# EAGLE design osmc_strip (EAGLE 5.10)
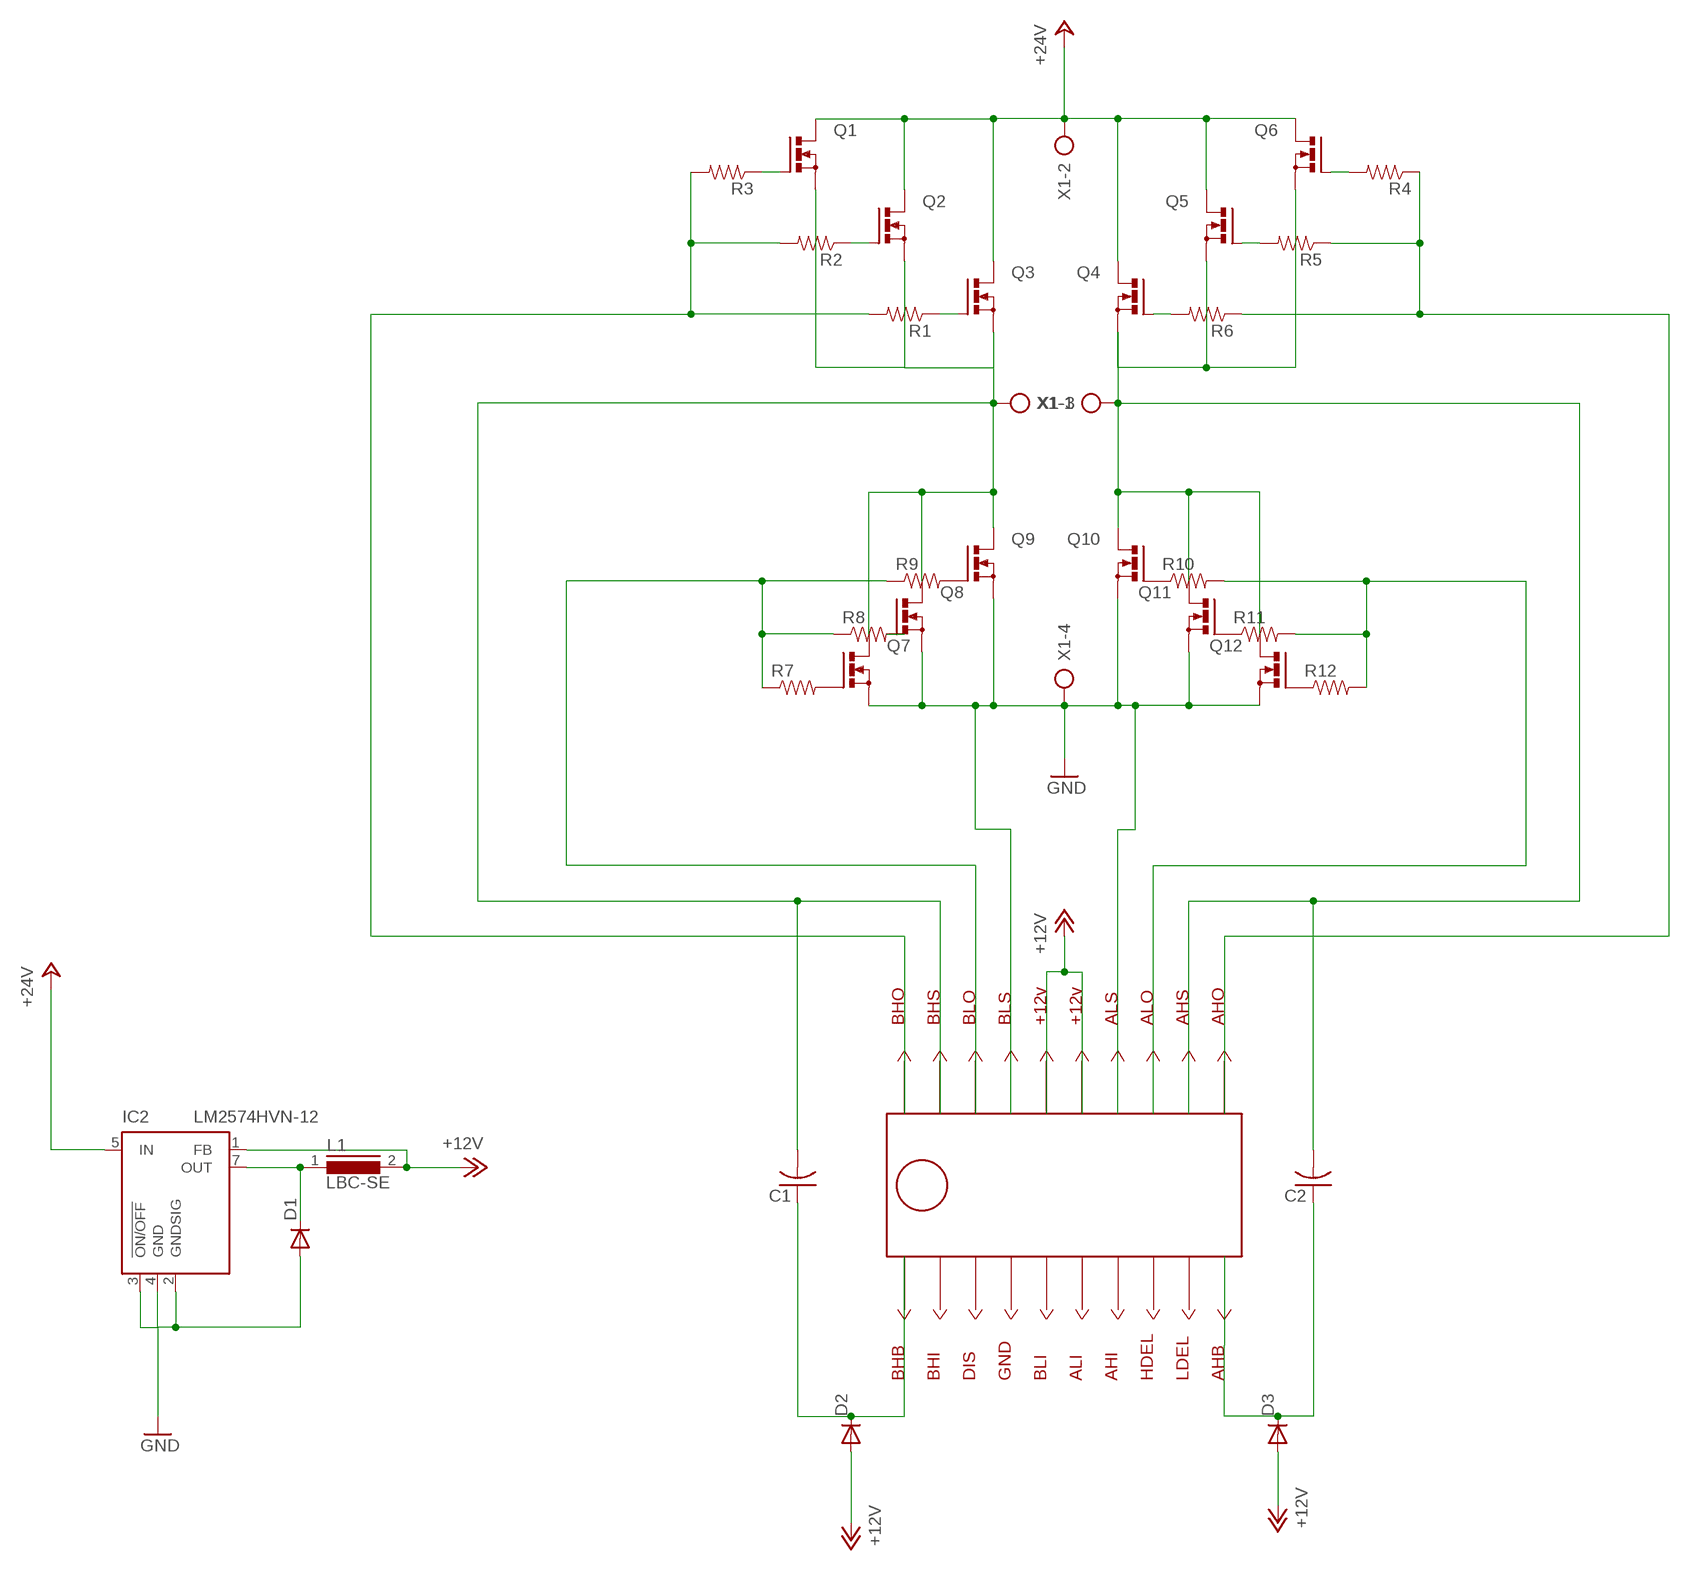
[diagram p0: schematic, sheet 1]

## Parts
C1  C-US050-030X075  [C050-030X075]
C2  C-US050-030X075  [C050-030X075]
D1  DIODEPTH  [DIODE-1N4001]
D2  DIODEPTH  [DIODE-1N4001]
D3  DIODEPTH  [DIODE-1N4001]
IC1  HIP4081  [HIP4081]
IC2  LM2574HVN-12  [DIL08]
L1  LBC-SE  [LBC-SE]
Q1  PMOSFET_NTO220BV  [TO220BV]
Q2  PMOSFET_NTO220BV  [TO220BV]
Q3  PMOSFET_NTO220BV  [TO220BV]
Q4  PMOSFET_NTO220BV  [TO220BV]
Q5  PMOSFET_NTO220BV  [TO220BV]
Q6  PMOSFET_NTO220BV  [TO220BV]
Q7  PMOSFET_NTO220BV  [TO220BV]
Q8  PMOSFET_NTO220BV  [TO220BV]
Q9  PMOSFET_NTO220BV  [TO220BV]
Q10  PMOSFET_NTO220BV  [TO220BV]
Q11  PMOSFET_NTO220BV  [TO220BV]
Q12  PMOSFET_NTO220BV  [TO220BV]
R1  RESISTORPTH-1/6W  [1/6W-RES]
R2  RESISTORPTH-1/6W  [1/6W-RES]
R3  RESISTORPTH-1/6W  [1/6W-RES]
R4  RESISTORPTH-1/6W  [1/6W-RES]
R5  RESISTORPTH-1/6W  [1/6W-RES]
R6  RESISTORPTH-1/6W  [1/6W-RES]
R7  RESISTORPTH-1/6W  [1/6W-RES]
R8  RESISTORPTH-1/6W  [1/6W-RES]
R9  RESISTORPTH-1/6W  [1/6W-RES]
R10  RESISTORPTH-1/6W  [1/6W-RES]
R11  RESISTORPTH-1/6W  [1/6W-RES]
R12  RESISTORPTH-1/6W  [1/6W-RES]
X1  AK500/4  [AK500/4]

## Nets
+12V: D2.A D3.A IC1.15(VCC) IC1.16(+12V) IC2.1(FB) L1.2
+24V: IC2.5(IN) Q1.D Q2.D Q3.D Q4.D Q5.D Q6.D X1.2
GND: D1.A IC1.14(ALS) IC1.17(BLS) IC2.2(GNDSIG) IC2.3(!ON/OFF) IC2.4(GND) Q7.S Q8.S Q9.S Q10.S Q11.S Q12.S X1.4
N$1: C1.2 IC1.19(BHS) Q1.S Q2.S Q3.S Q7.D Q8.D Q9.D X1.3
N$2: C2.2 IC1.12(AHS) Q4.S Q5.S Q6.S Q10.D Q11.D Q12.D X1.1
N$3: IC1.11(AHO) R4.1 R5.1 R6.1
N$4: C1.1 D2.C IC1.1(BHB)
N$6: Q4.G R6.2
N$7: Q11.G R11.1
N$8: Q10.G R10.1
N$9: Q12.G R12.1
N$10: Q7.G R7.2
N$11: Q8.G R8.2
N$12: Q9.G R9.2
N$13: D1.C IC2.7(OUT) L1.1
N$14: C2.1 D3.C IC1.10(AHB)
N$15: Q5.G R5.2
N$16: Q6.G R4.2
N$17: Q1.G R3.1
N$18: Q2.G R2.1
N$19: Q3.G R1.1
N$20: IC1.20(BHO) R1.2 R2.2 R3.2
N$22: IC1.18(BLO) R7.1 R8.1 R9.1
N$23: IC1.13(ALO) R10.2 R11.2 R12.2
Unconnected: IC1.2(BHI) IC1.3(DIS) IC1.4(GND) IC1.5(BLI) IC1.6(ALI) IC1.7(AHI) IC1.8(HDEL) IC1.9(LDEL)

## Library data of the parts
C1 C2 = rcl:C-US: CAPACITOR, American symbol
D1-D3 = SparkFun:DIODE: Diode These are standard reverse protection diodes and small signal diodes. SMA package can handle up to about 1A. SOD-323 can handle about 200mA. What the SOD-323 package when ordering, there are some mfgs out there that are 5-pin packages.
IC1 = A-JD3:HIP4081
IC2 = linear:LM2574?-*: SIMPLE SWITCHER 0.5A Step-Down Voltage Regulator Source: http://cache.national.com/ds/LM/LM2574.pdf
L1 = inductors:LBC-SE: INDUCTOR
Q1-Q12 = transistor-power:PMOSFET_N: Power MOSFET N-Channel
R1-R12 = SparkFun:RESISTOR: Resistor Basic schematic elements and footprints for 0603, 1206, and PTH 1/10th watt (small) resistors.
X1 = con-ptr500:AK500/4: CONNECTOR

## Board
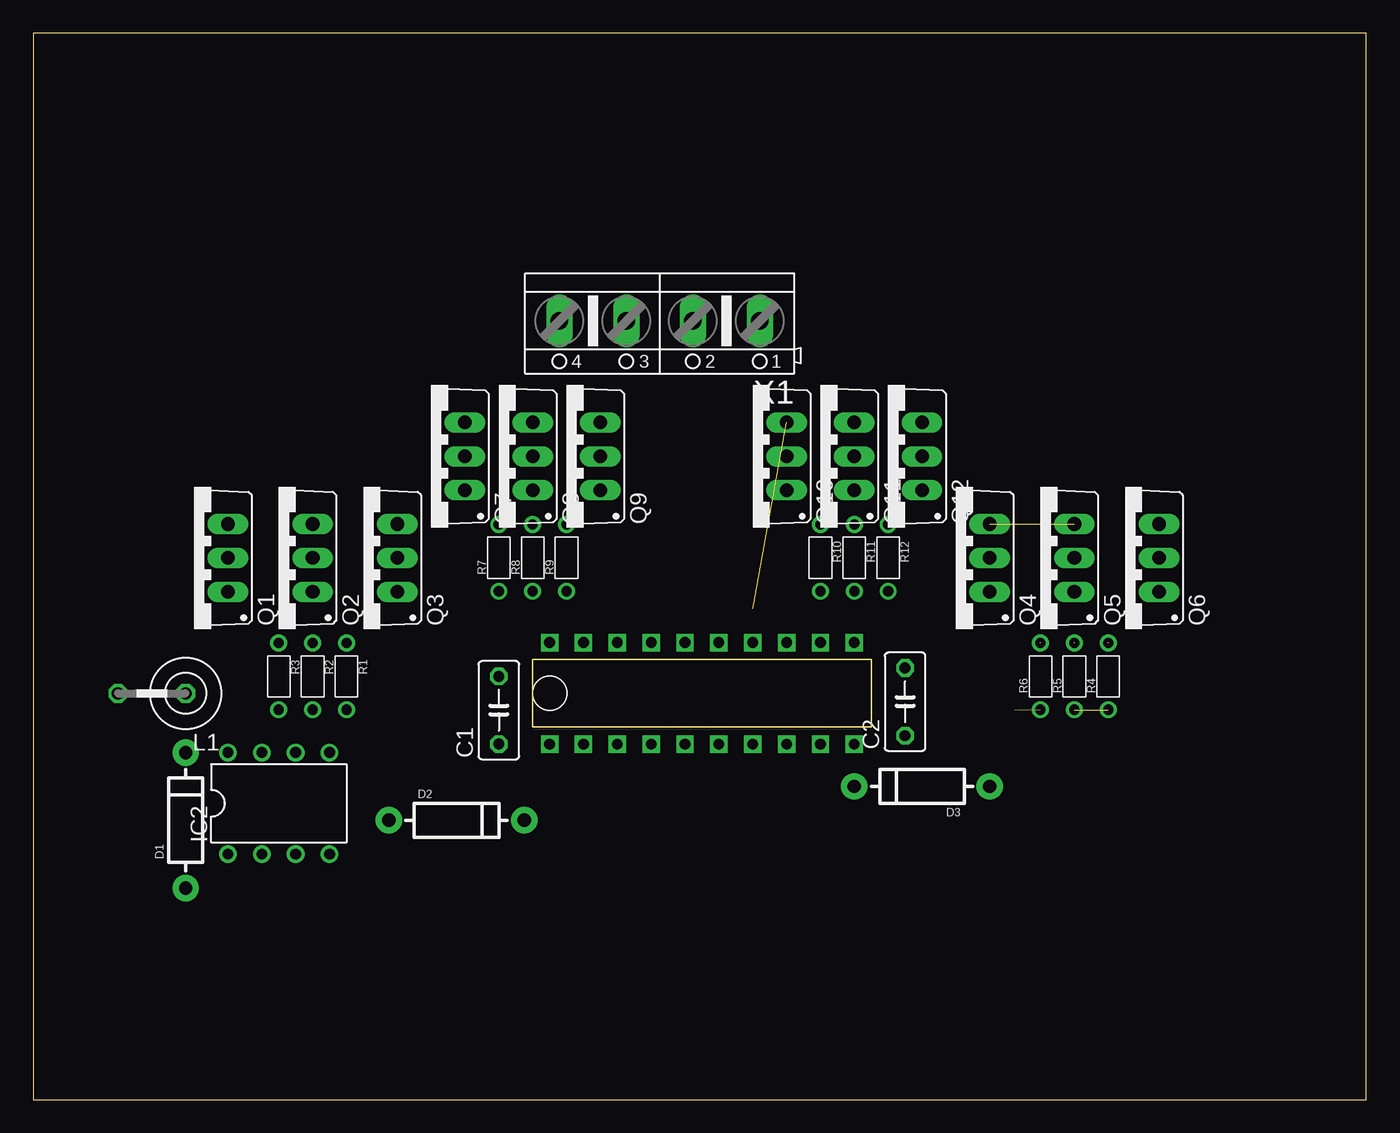
[diagram p1: board, top side]
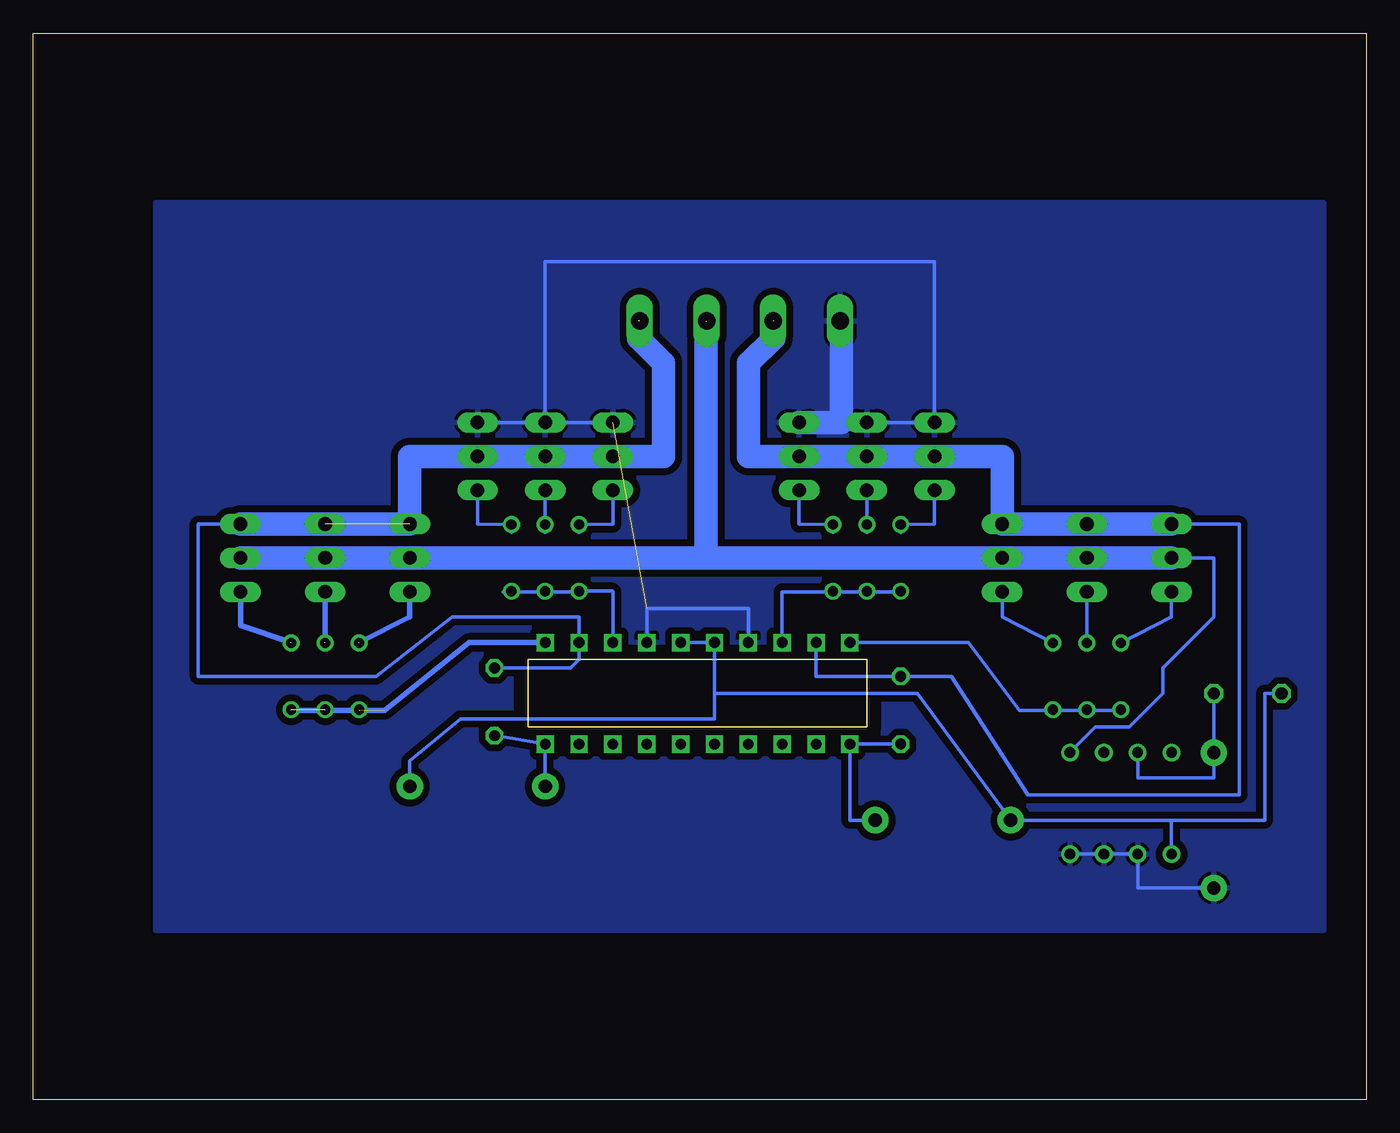
[diagram p2: board, bottom side, seen from below]

Size 100 x 80 mm. Coordinates in mm from the lower left corner, seen from the top.
Outline: 0,0 100,0 100,80 0,80 0,0
Copper layers (1*16): Top 0.035mm / dielectric 1.5mm / Bottom 0.035mm
Design rules "default *": minimum track width 10mil, minimum drill 24mil, track to track 20mil, track to pad 20mil, pad to pad 8mil, via to via 8mil, smd to smd 8mil, copper to edge 40mil, drill to drill 8mil, minimum pad ring 10mil, minimum via ring 8mil, stop-mask expansion 4mil, vias tented up to drill 0mil, thermal gap 10mil

### Footprints (pad centres in the part's own frame; a part is rotated, then mirrored left to right if it is on the bottom)
C050-030X075 = drill 0.813 octagon: 1 -2.54,0; 2 2.54,0
DIODE-1N4001 = drill 1 pad 1.981 round: A -5.08,0; C 5.08,0
HIP4081 = drill 0.8 square: 1 -11.43,-3.81; 2 -8.89,-3.81; 3 -6.35,-3.81; 4 -3.81,-3.81; 5 -1.27,-3.81; 6 1.27,-3.81; 7 3.81,-3.81; 8 6.35,-3.81; 9 8.89,-3.81; 10 11.43,-3.81; 11 11.43,3.81; 12 8.89,3.81; 13 6.35,3.81; 14 3.81,3.81; 15 1.27,3.81; 16 -1.27,3.81; 17 -3.81,3.81; 18 -6.35,3.81; 19 -8.89,3.81; 20 -11.43,3.81
DIL08 = drill 0.813 pad 1.27 round: 1 -3.81,-3.81; 2 -1.27,-3.81; 3 1.27,-3.81; 4 3.81,-3.81; 5 3.81,3.81; 6 1.27,3.81; 7 -1.27,3.81; 8 -3.81,3.81
LBC-SE = drill 0.914 octagon: 1 -2.54,0; 2 2.54,0
TO220BV = drill 1.016 long: D 0,-2.54; G -2.54,-2.54; S 2.54,-2.54
1/6W-RES = drill 0.762 round: 1 -2.5,0; 2 2.5,0
AK500/4 = drill 1.321 long: 1 -7.518,0; 2 -2.489,0; 3 2.489,0; 4 7.518,0

### Placement (x,y rotation side)
C1  34.92,29.21 90 top
C2  65.41,29.84 90 top
D1  11.43,20.95 90 top
D2  31.75,20.95 0 top
D3  66.67,23.5 180 top
IC1  50.16,30.48 0 top
IC2  18.41,22.23 0 top
L1  8.89,30.48 180 top
Q1  12.06,40.64 90 top
Q2  18.41,40.64 90 top
Q3  24.77,40.64 90 top
Q4  69.22,40.64 90 top
Q5  75.56,40.64 90 top
Q6  81.92,40.64 90 top
Q7  29.84,48.26 90 top
Q8  34.92,48.26 90 top
Q9  40.01,48.26 90 top
Q10  53.98,48.26 90 top
Q11  59.05,48.26 90 top
Q12  64.14,48.26 90 top
R1  23.5,31.75 270 top
R2  20.95,31.75 270 top
R3  18.41,31.75 270 top
R4  80.64,31.75 90 top
R5  78.11,31.75 90 top
R6  75.56,31.75 90 top
R7  34.92,40.64 90 top
R8  37.47,40.64 90 top
R9  40.01,40.64 90 top
R10  59.05,40.64 270 top
R11  61.59,40.64 270 top
R12  64.14,40.64 270 top
X1  46.99,58.42 180 top

### Tracks (layer width: path | path; a pad name or v marks a point on that pad's centre or on a via)
+12V
  Bottom 0.254: L1.2 7.62,30.48 7.62,20.95 14.61,20.95 | IC1.16 48.9,30.48 33.66,30.48 D2.A 14.61,20.95 | 14.61,20.95 IC2.1 | D3.A 71.75,25.4 67.94,28.57 48.9,28.57 IC1.16 | IC1.16 IC1.15
+24V  (1 unrouted)
  Bottom 0.254: Q1.D 11.43,40.64 11.43,36.2 15.24,32.38 15.24,30.48 17.78,27.94 20.32,27.94 IC2.5
  Bottom 1.778: Q1.D Q2.D Q3.D 49.53,40.64 | 49.53,40.64 Q4.D Q5.D Q6.D | 49.53,40.64 49.53,58.42
GND  (1 unrouted)
  Bottom 0.254: 39.37,50.8 Q8.S Q7.S 32.38,62.87 61.59,62.87 Q11.S | IC1.17 46.35,36.83 53.98,36.83 IC1.14 | Q11.S Q12.S | Q11.S Q10.S | D1.A 17.14,15.88 IC2.2 IC2.3 IC2.4
  Bottom 1.778: Q9.S 39.37,50.8 39.37,58.42
  pour Bottom: 3.17,67.31 3.17,12.7 90.81,12.7 90.81,67.31
N$1  (1 unrouted)
  Bottom 0.254: Q3.S 27.3,43.81 | 12.7,43.18 Q1.S 9.53,43.18 9.53,22.86 25.4,22.86 31.11,31.75 C1.2 41.27,31.75 IC1.19
  Bottom 0.406: 27.94,48.26 27.3,48.26 Q3.S
  Bottom 1.778: Q1.S Q2.S Q3.S | 27.3,43.81 27.3,48.26 Q7.D Q8.D Q9.D 46.35,48.26 46.35,55.24 44.45,57.15 44.45,58.42
N$2  (2 unrouted)
  Bottom 0.254: Q6.S 87.63,43.18 87.63,31.75 74.3,31.75 68.58,36.2 59.05,36.2 IC1.12 59.05,33.02 59.69,32.38 C2.2 | 54.61,58.42 55.24,58.42
  Bottom 1.778: Q6.S Q4.S 71.75,48.26 Q12.D Q11.D Q10.D 52.7,48.26 52.7,55.24 54.61,57.15 54.61,58.42
N$3  (3 unrouted)
  Bottom 0.406: IC1.11 67.31,34.29 73.66,29.21 80.64,29.21
N$4
  Bottom 0.254: C1.1 IC1.1 38.73,20.95 D2.C
N$6  (1 unrouted)
  Bottom 0.406: Q4.G 71.75,36.2 75.56,34.29
N$7
  Bottom 0.254: Q11.G R11.1 61.59,42.55
N$8
  Bottom 0.254: Q10.G 56.52,43.18 R10.1 59.05,42.55
N$9
  Bottom 0.254: Q12.G 66.67,43.18 R12.1 64.14,42.55
N$10
  Bottom 0.254: Q7.G 32.38,43.18 R7.2 34.92,42.55
N$11
  Bottom 0.254: Q8.G R8.2 37.47,42.55
N$12
  Bottom 0.254: Q9.G 42.55,43.18 R9.2 40.01,42.55
N$13
  Bottom 0.254: L1.1 D1.C 11.43,24.13 17.14,24.13 IC2.7
N$14
  Bottom 0.254: C2.1 IC1.10 D3.C
N$15  (1 unrouted)
  Bottom 0.406: 78.11,34.29 Q5.G
N$16  (1 unrouted)
  Bottom 0.406: Q6.G 84.45,35.56 80.64,34.29
N$17
  Bottom 0.254: R3.1 14.61,36.2 Q1.G
N$18
  Bottom 0.254: R2.1 Q2.G
N$19
  Bottom 0.254: R1.1 27.3,36.2 Q3.G
N$20
  Bottom 0.254: 21.59,29.21 18.41,29.21 R3.2 | 21.59,29.21 23.5,29.21 | 21.59,29.21 R2.2 | 23.5,29.21 26.04,29.21 29.84,34.29 IC1.20 | 23.5,29.21 R1.2
N$22
  Bottom 0.254: 38.1,38.1 35.56,38.1 R7.1 | 38.1,38.1 40.01,38.1 | 38.1,38.1 R8.1 | IC1.18 43.81,38.1 40.01,38.1 | 40.01,38.1 R9.1
N$23
  Bottom 0.254: 62.23,38.1 59.69,38.1 R10.2 56.55,38.14 56.52,38.1 IC1.13 | 62.23,38.1 64.77,38.1 R12.2 | 62.23,38.1 R11.2